# EAGLE design MotorDriverModule_s (EAGLE 6.4)
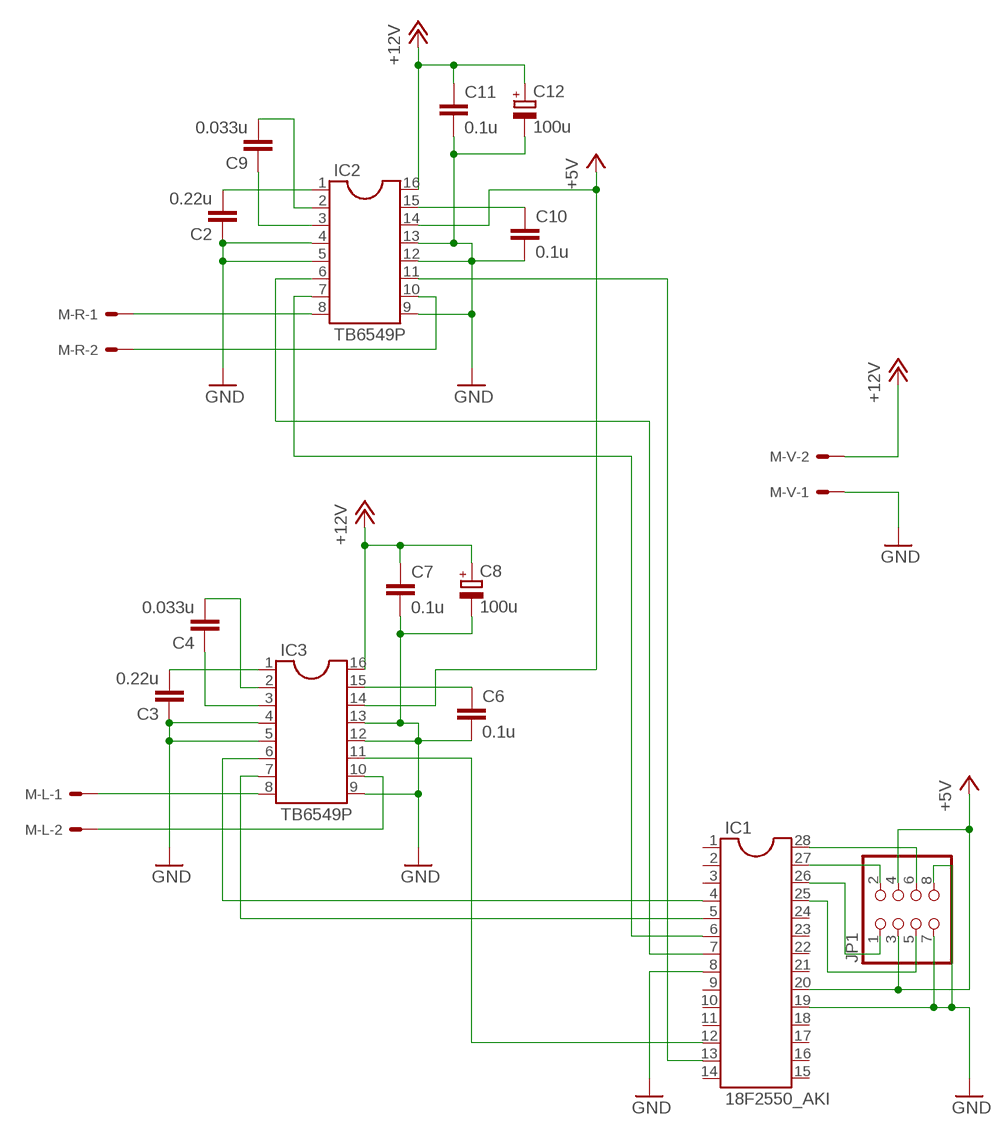
[diagram p0: schematic, sheet 1]

## Parts
C2  0.22u  C-EUC2012  [C2012]
C3  0.22u  C-EUC2012  [C2012]
C4  0.033u  C-EUC2012  [C2012]
C6  0.1u  C-EUC2012  [C2012]
C7  0.1u  C-EUC2012  [C2012]
C8  100u  CPOL-EUD/7343-31W  [D/7343-31W]
C9  0.033u  C-EUC2012  [C2012]
C10  0.1u  C-EUC2012  [C2012]
C11  0.1u  C-EUC2012  [C2012]
C12  100u  CPOL-EUD/7343-31W  [D/7343-31W]
IC1  18F2550_AKI  [18F2550_AKI]
IC2  TB6549P  [TB6549P]
IC3  TB6549P  [TB6549P]
JP1  PINHD-2X4  [2X04]
M-L  KK-156-2  [KK-156-2]
M-R  KK-156-2  [KK-156-2]
M-V  KK-156-2  [KK-156-2]

## Nets
+5V: IC1.20 IC2.14 IC3.14 JP1.3 JP1.4
+12V: C7.1 C8.+ C11.1 C12.+ IC2.16 IC3.16 M-V.2
GND: C2.1 C3.1 C6.2 C7.2 C8.- C10.2 C11.2 C12.- IC1.8 IC1.19 IC2.4 IC2.5 IC2.9 IC2.12 IC2.13 IC3.4 IC3.5 IC3.9 IC3.12 IC3.13 JP1.7 JP1.8 M-V.1
N$1: IC1.12 IC3.11
N$2: IC1.4 IC3.6
N$3: IC1.5 IC3.7
N$4: IC3.8 M-L.1
N$5: IC3.10 M-L.2
N$6: C3.2 IC3.1
N$7: C4.2 IC3.2
N$8: C4.1 IC3.3
N$9: C6.1 IC3.15
N$10: IC1.28 JP1.6
N$11: IC1.13 IC2.11
N$12: IC1.7 IC2.6
N$13: IC1.6 IC2.7
N$14: IC2.8 M-R.1
N$15: IC1.27 JP1.2
N$16: IC1.26 JP1.1
N$17: IC1.25 JP1.5
N$18: IC2.10 M-R.2
N$19: C2.2 IC2.1
N$20: C9.2 IC2.2
N$21: C9.1 IC2.3
N$24: C10.1 IC2.15
Unconnected: IC1.1 IC1.2 IC1.3 IC1.9 IC1.10 IC1.11 IC1.14 IC1.15 IC1.16 IC1.17 IC1.18 IC1.21 IC1.22 IC1.23 IC1.24

## Library data of the parts
C2-C4 C6 C7 C9-C11 = resistor:C-EU: CAPACITOR, European symbol
C8 C12 = rcl:CPOL-EU: POLARIZED CAPACITOR, European symbol
IC1 = 18F2550_AKI:18F2550_AKI: 18F2550 AKITUKI
IC2 IC3 = TB6549:TB6549P: MotorDriverIC IN1 IN2 PWM OUT1 OUT2
JP1 = pinhead:PINHD-2X4: PIN HEADER
M-L M-R M-V = con-molex:KK-156-2: KK 156 HEADER Source: http://www.molex.com/pdm_docs/sd/026604100_sd.pdf; OC_FARNELL: unknown; OC_NEWARK: unknown

## Board
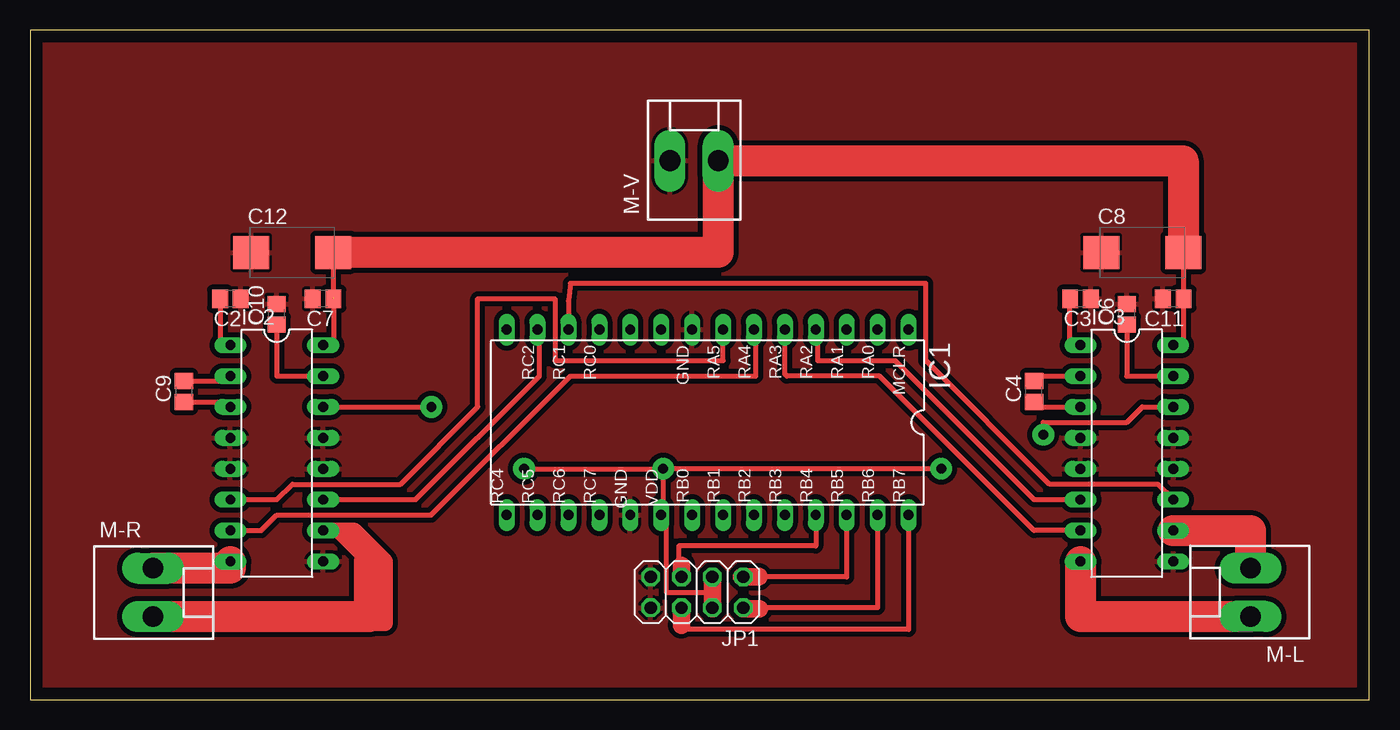
[diagram p1: board, top side]
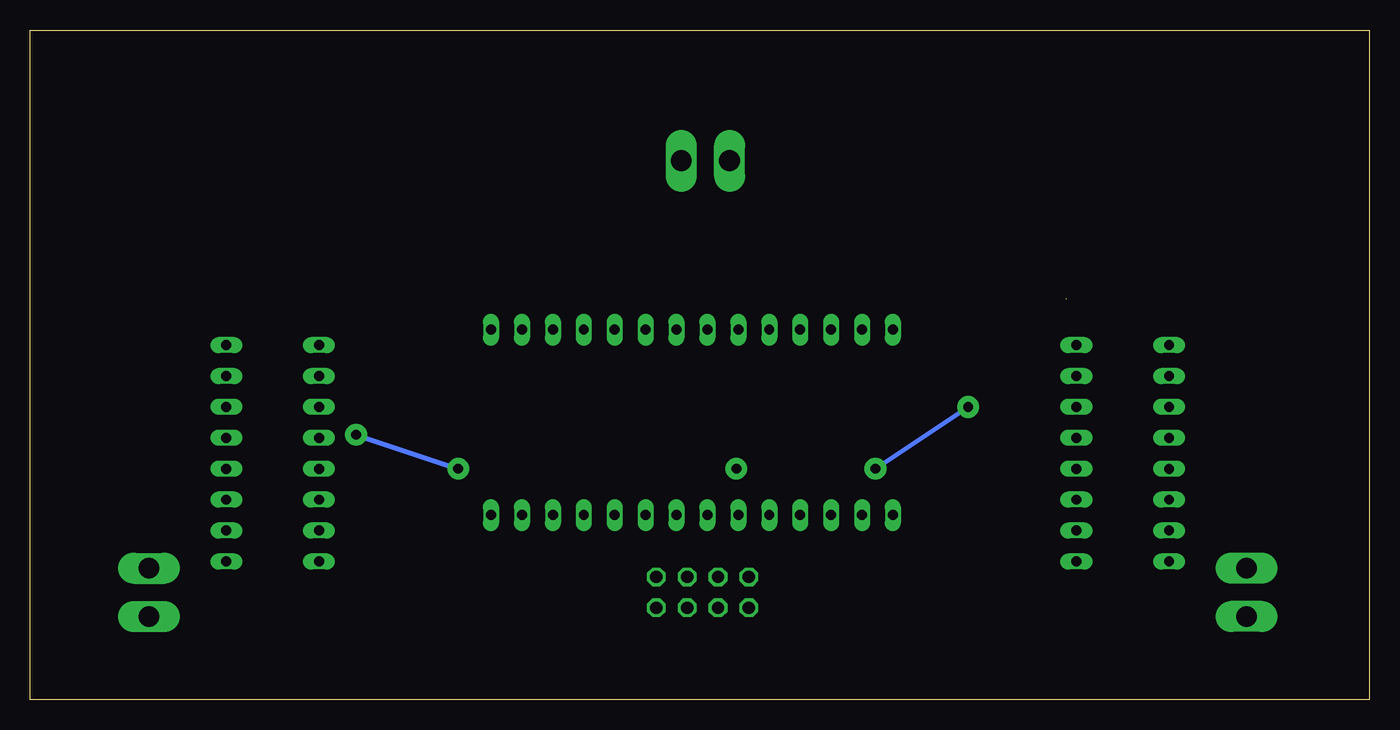
[diagram p2: board, bottom side, seen from below]

Size 110 x 55 mm. Coordinates in mm from the lower left corner, seen from the top.
Outline: 0,0 110,0 110,55 0,55 0,0
Copper layers (1*16): Top 0.035mm / dielectric 1.5mm / Bottom 0.035mm
Design rules "default": minimum track width 10mil, minimum drill 24mil, track to track 8mil, track to pad 8mil, pad to pad 8mil, via to via 8mil, smd to smd 8mil, copper to edge 40mil, drill to drill 8mil, minimum pad ring 10mil, minimum via ring 8mil, stop-mask expansion 4mil, vias tented up to drill 0mil, thermal gap 10mil

### Footprints (pad centres in the part's own frame; a part is rotated, then mirrored left to right if it is on the bottom)
C2012 = smd 1.3 x 1.5: 1 -0.85,0; 2 0.85,0
D/7343-31W = smd 2.95 x 2.7: + 3.375,0; - -3.375,0
18F2550_AKI = drill 0.813 long: 1 -7.62,17.78; 2 -7.62,15.24; 3 -7.62,12.7; 4 -7.62,10.16; 5 -7.62,7.62; 6 -7.62,5.08; 7 -7.62,2.54; 8 -7.62,0; 9 -7.62,-2.54; 10 -7.62,-5.08; 11 -7.62,-7.62; 12 -7.62,-10.16; 13 -7.62,-12.7; 14 -7.62,-15.24; 15 7.62,-15.24; 16 7.62,-12.7; 17 7.62,-10.16; 18 7.62,-7.62; 19 7.62,-5.08; 20 7.62,-2.54; 21 7.62,0; 22 7.62,2.54; 23 7.62,5.08; 24 7.62,7.62; 25 7.62,10.16; 26 7.62,12.7; 27 7.62,15.24; 28 7.62,17.78
TB6549P = drill 0.813 long: 1 -8.89,-3.81; 2 -6.35,-3.81; 3 -3.81,-3.81; 4 -1.27,-3.81; 5 1.27,-3.81; 6 3.81,-3.81; 7 6.35,-3.81; 8 8.89,-3.81; 9 8.89,3.81; 10 6.35,3.81; 11 3.81,3.81; 12 1.27,3.81; 13 -1.27,3.81; 14 -3.81,3.81; 15 -6.35,3.81; 16 -8.89,3.81
2X04 = drill 1.016 octagon: 1 -3.81,-1.27; 2 -3.81,1.27; 3 -1.27,-1.27; 4 -1.27,1.27; 5 1.27,-1.27; 6 1.27,1.27; 7 3.81,-1.27; 8 3.81,1.27
KK-156-2 = drill 1.7 pad 2.184 long: 1 -1.98,0; 2 1.98,0

### Placement (x,y rotation side)
C2  16.43,32.94 180 top
C3  86.28,32.94 180 top
C4  82.47,25.32 90 top
C6  90.09,31.67 90 top
C7  24.05,32.94 180 top
C8  91.36,36.75 0 top
C9  12.62,25.32 90 top
C10  20.24,31.67 90 top
C11  93.9,32.94 180 top
C12  21.51,36.75 0 top
IC1  54.37,22.78 270 top
IC2  20.24,20.24 270 top
IC3  90.09,20.24 270 top
JP1  54.77,8.81 180 top
M-L  100.25,8.81 90 top
M-R  10.08,8.81 270 top
M-V  54.53,44.29 0 top

### Tracks (layer width: path | path; a pad name or v marks a point on that pad's centre or on a via)
+5V  (via drill 0.8 pad 1.78)
  Top 0.406: v40.56,18.97 v51.99,18.97 | IC2.14 v32.94,24.05 | v51.99,18.97 51.99,15.32 IC1.20 52.24,14.75 52.24,8.81 56.04,8.81 | JP1.3 56.04,8.81 | 56.04,8.81 JP1.4 | v74.85,18.97 v51.99,18.97 | v83.23,21.76 83.23,22.78 90.09,22.78 91.36,24.05 IC3.14
  Bottom 0.406: v32.94,24.05 v40.56,18.97 | v83.23,21.76 v74.85,18.97
+12V  (1 unrouted)
  Top 0.406: C7.1 24.9,29.13 IC2.16 | C12.+ 24.89,32.94 | IC3.16 94.75,29.13 C11.1 94.73,32.94 C8.+
  Top 2.54: C8.+ 94.73,44.29 M-V.2 56.51,36.75 C12.+
GND
  pour Top (isolate 0.406): 0,55 110,55 110,0 0,0
N$1
  Top 0.406: IC3.11 92.63,17.7 83.74,17.7 73.58,27.86 73.58,34.21 44.37,34.21 44.21,32.78 IC1.12
N$2
  Top 0.406: IC1.4 64.69,30.24 64.69,27.86 71.04,27.86 82.47,16.43 IC3.6
N$3
  Top 0.406: IC3.7 82.47,13.89 69.77,26.59 62.15,26.59 61.99,26.75 IC1.5
N$4
  Top 2.54: IC3.8 86.28,6.83 M-L.1
N$5
  Top 2.54: IC3.10 100.25,13.89 M-L.2
N$6
  Top 0.406: IC3.1 85.43,29.13 C3.2
N$7
  Top 0.406: C4.2 82.47,26.59 IC3.2
N$8
  Top 0.406: C4.1 82.47,24.05 IC3.3
N$9
  Top 0.406: C6.1 90.09,26.59 IC3.15
N$10
  Top 0.406: IC1.28 72.15,5.76 53.5,5.76 JP1.6
N$11
  Top 0.406: IC2.11 31.67,16.43 41.83,26.59 41.83,30.24 IC1.13
N$12
  Top 0.406: IC2.6 20.24,16.43 21.51,17.7 30.4,17.7 36.75,24.05 36.75,32.94 43.1,32.94 43.1,27.86 56.91,27.86 IC1.7
N$13
  Top 0.406: IC2.7 18.97,13.89 20.24,15.16 32.94,15.16 44.37,26.59 59.61,26.59 59.61,30.24 IC1.6
N$14
  Top 2.54: IC2.8 16.43,10.79 M-R.1
N$15
  Top 0.406: IC1.27 69.61,7.54 JP1.2
N$16
  Top 0.406: IC1.26 67.07,10.08 JP1.1
N$17
  Top 0.406: IC1.25 64.53,12.62 53.26,12.62 53.26,10.08 JP1.5
N$18
  Top 1.27: 27.86,11.35 25.32,13.89 | IC2.10 25.32,13.89 | 25.32,13.89 26.59,13.89 29.13,11.35 29.13,6.27 22.78,6.27
  Top 2.54: M-R.2 27.86,6.83 27.86,11.35
N$19
  Top 0.406: C2.2 15.58,29.13 IC2.1
N$20
  Top 0.406: C9.2 16.43,26.17 IC2.2
N$21
  Top 0.406: C9.1 16.43,24.47 IC2.3
N$22
  Top 1.422: 56.1,10.05 56.05,10.05 56.05,7.46
N$23
  Top 1.422: 58.44,10.08 59.86,10.08 59.86,10.11
N$24
  Top 0.406: C10.1 20.24,26.59 IC2.15
N$25
  Top 1.422: 58.54,7.46 59.91,7.46
N$26
  Top 1.422: 53.59,10 53.51,10 53.51,11.04
N$27
  Top 1.422: 53.51,7.52 53.49,7.52 53.49,6.12